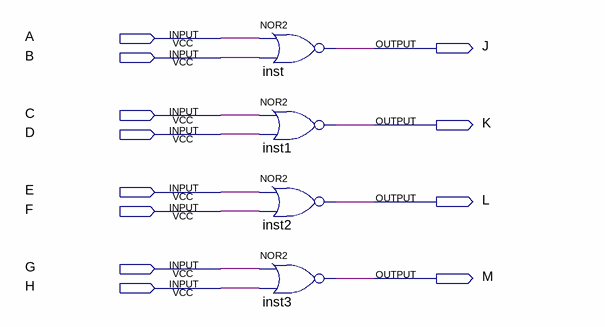
[diagram p0: schematic sheet]
// Quartus schematic CD4001.bdf as structural Verilog: 4 symbols, 12 pins
module CD4001 (
  input  A,
  input  B,
  input  C,
  input  D,
  input  E,
  input  F,
  input  G,
  input  H,
  output J,
  output K,
  output L,
  output M
);

  nor inst (J, A, B);
  nor inst1 (K, C, D);
  nor inst2 (L, E, F);
  nor inst3 (M, G, H);
endmodule
